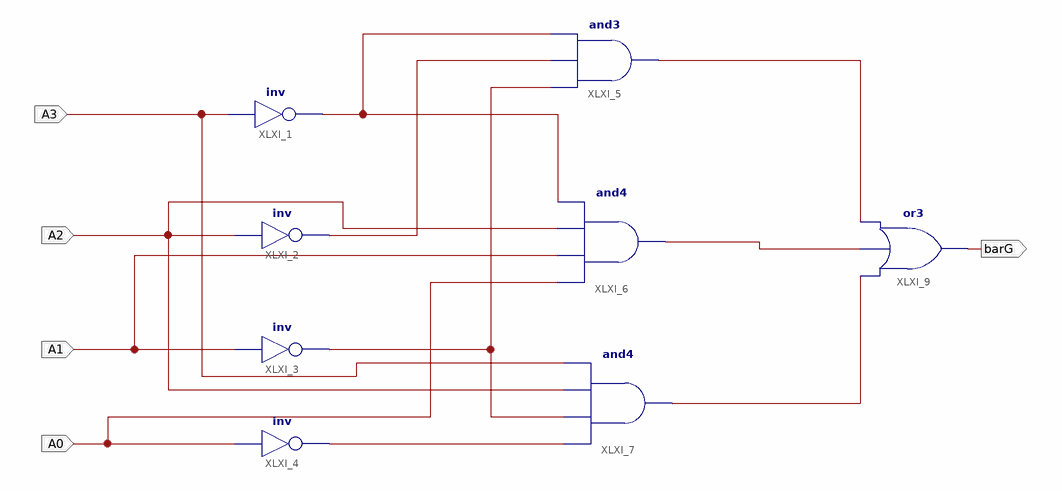
[diagram p0: schematic sheet 1]
// Xilinx ISE schematic fnd7.sch (spartan6) as structural Verilog: 8 symbols, 5 ports
module fnd7 (
  input  A3,
  input  A2,
  input  A1,
  input  A0,
  output barG
);

  wire XLXN_9, XLXN_10, XLXN_12, XLXN_17, XLXN_18, XLXN_19, XLXN_20;

  not XLXI_1 (XLXN_9, A3);
  not XLXI_2 (XLXN_10, A2);
  not XLXI_3 (XLXN_12, A1);
  not XLXI_4 (XLXN_17, A0);
  and XLXI_5 (XLXN_18, XLXN_12, XLXN_10, XLXN_9);
  and XLXI_6 (XLXN_19, A0, A1, A2, XLXN_9);
  and XLXI_7 (XLXN_20, XLXN_17, XLXN_12, A2, A3);
  or XLXI_9 (barG, XLXN_20, XLXN_19, XLXN_18);
endmodule
